# Altium schematic sheet Sch_led.SchDoc
size Letter
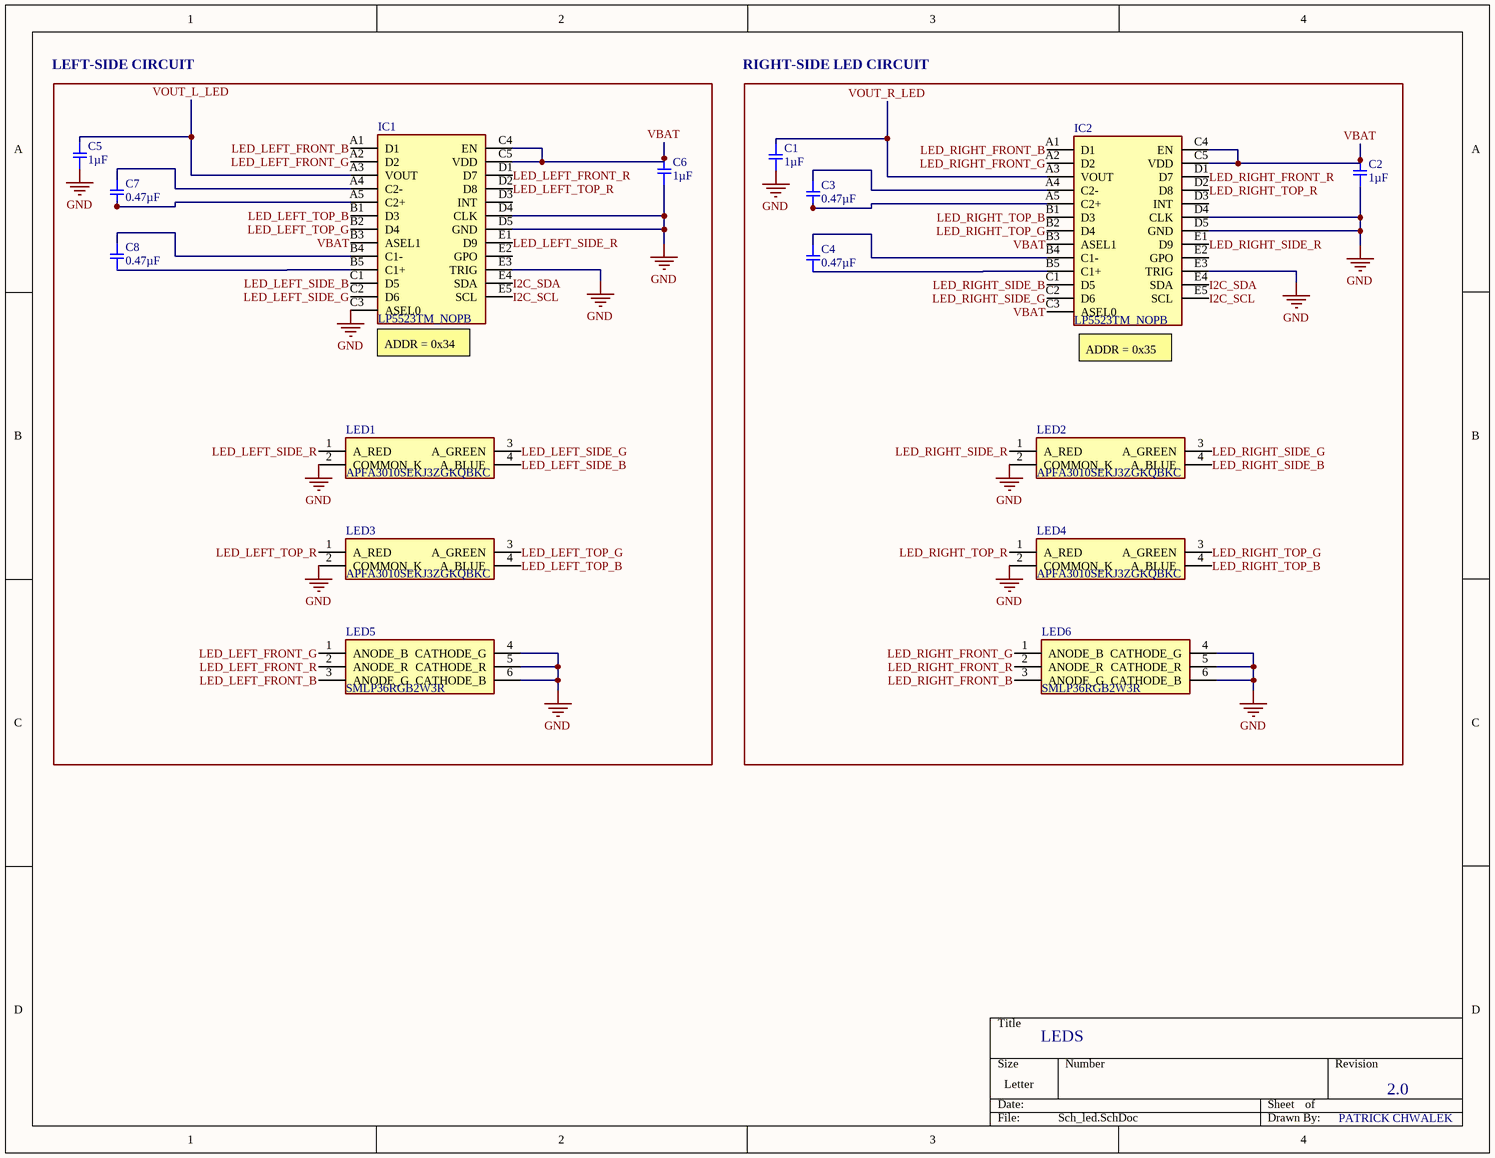
[diagram p0: Sch_led.SchDoc]

## Parts
C1  1µF  [0402R]
C2  1µF  [0402R]
C3  0.47µF  [0402R]
C4  0.47µF  [0402R]
C5  1µF  [0402R]
C6  1µF  [0402R]
C7  0.47µF  [0402R]
C8  0.47µF  [0402R]
IC1  LP5523TM_NOPB  [BGA25C40P5X5_226X226X68]
IC2  LP5523TM_NOPB  [BGA25C40P5X5_226X226X68]
LED1  APFA3010SEKJ3ZGKQBKC  [KPFA-3010RGBC-11]
LED2  APFA3010SEKJ3ZGKQBKC  [KPFA-3010RGBC-11]
LED3  APFA3010SEKJ3ZGKQBKC  [KPFA-3010RGBC-11]
LED4  APFA3010SEKJ3ZGKQBKC  [KPFA-3010RGBC-11]
LED5  SMLP36RGB2W3R  [ROHM-1510-(0604)]
LED6  SMLP36RGB2W3R  [ROHM-1510-(0604)]

## Blocks framed on the sheet
LEFT-SIDE CIRCUIT: C5-C8 IC1 LED1 LED3 LED5
RIGHT-SIDE LED CIRCUIT: C1-C4 IC2 LED2 LED4 LED6

## Nets
GND: C1.1 C2.1 C5.1 C6.1 IC1.C3(ASEL0) IC1.D4(CLK) IC1.D5(GND) IC1.E3(TRIG) IC2.D4(CLK) IC2.D5(GND) IC2.E3(TRIG) LED1.2(COMMON_K) LED2.2(COMMON_K) LED3.2(COMMON_K) LED4.2(COMMON_K) LED5.4(CATHODE_G) LED5.5(CATHODE_R) LED5.6(CATHODE_B) LED6.4(CATHODE_G) LED6.5(CATHODE_R) LED6.6(CATHODE_B)
I2C_SCL: IC1.E5(SCL) IC2.E5(SCL)
I2C_SDA: IC1.E4(SDA) IC2.E4(SDA)
LED_LEFT_FRONT_B: IC1.A1(D1) LED5.3(ANODE_G)
LED_LEFT_FRONT_G: IC1.A2(D2) LED5.1(ANODE_B)
LED_LEFT_FRONT_R: IC1.D1(D7) LED5.2(ANODE_R)
LED_LEFT_SIDE_B: IC1.C1(D5) LED1.4(A_BLUE)
LED_LEFT_SIDE_G: IC1.C2(D6) LED1.3(A_GREEN)
LED_LEFT_SIDE_R: IC1.E1(D9) LED1.1(A_RED)
LED_LEFT_TOP_B: IC1.B1(D3) LED3.4(A_BLUE)
LED_LEFT_TOP_G: IC1.B2(D4) LED3.3(A_GREEN)
LED_LEFT_TOP_R: IC1.D2(D8) LED3.1(A_RED)
LED_RIGHT_FRONT_B: IC2.A1(D1) LED6.3(ANODE_G)
LED_RIGHT_FRONT_G: IC2.A2(D2) LED6.1(ANODE_B)
LED_RIGHT_FRONT_R: IC2.D1(D7) LED6.2(ANODE_R)
LED_RIGHT_SIDE_B: IC2.C1(D5) LED2.4(A_BLUE)
LED_RIGHT_SIDE_G: IC2.C2(D6) LED2.3(A_GREEN)
LED_RIGHT_SIDE_R: IC2.E1(D9) LED2.1(A_RED)
LED_RIGHT_TOP_B: IC2.B1(D3) LED4.4(A_BLUE)
LED_RIGHT_TOP_G: IC2.B2(D4) LED4.3(A_GREEN)
LED_RIGHT_TOP_R: IC2.D2(D8) LED4.1(A_RED)
VBAT: C2.2 C6.2 IC1.B3(ASEL1) IC1.C4(EN) IC1.C5(VDD) IC2.B3(ASEL1) IC2.C3(ASEL0) IC2.C4(EN) IC2.C5(VDD)
VOUT_L_LED: C5.2 IC1.A3(VOUT)
VOUT_R_LED: C1.2 IC2.A3(VOUT)
NetC3_1: C3.1 IC2.A5(C2+)
NetC3_2: C3.2 IC2.A4(C2-)
NetC4_1: C4.1 IC2.B5(C1+)
NetC4_2: C4.2 IC2.B4(C1-)
NetC7_1: C7.1 IC1.A5(C2+)
NetC7_2: C7.2 IC1.A4(C2-)
NetC8_1: C8.1 IC1.B5(C1+)
NetC8_2: C8.2 IC1.B4(C1-)

Not connected (* = marked no-connect by the designer): IC1 D3(INT) E2(GPO); IC2 D3(INT) E2(GPO)

## Notes on the sheet
- (near IC1) ADDR = 0x34
- (near IC2) ADDR = 0x35
- LEDS
- 2.0
- PATRICK CHWALEK

## Library data of the parts
C1 C2 C5 C6 = GCM155C71A105KE38D: CAP CER 1UF 10V X7S 0402; Manufacturer: Murata Electronics North America; Factory Stock: 0; Unit Price (USD): 0.12; Minimum Quantity: 1; Tolerance: ±10%; Datasheets: http://www.murata.com/~/media/webrenewal/support/library/catalog/products/capacitor/mlcc/c03e.ashx; Image: //media.digikey.com/Renders/Murata%20Renders/ZRB-SERIES-0402.jpg; Digi-Key Part Number: 490-13409-1-ND; Part Number: GCM155C71A105KE38D; Quantity Available: 7240; @ qty: 0; Packaging: Cut Tape (CT); Series: GCM; Part Status: Active; Value: 1µF; Voltage: 10V; Temperature Coefficient: X7S; Operating Temperature: -55°C ~ 125°C; Features: -; Ratings: AEC-Q200; Applications: Automotive; Mounting Type: Surface Mount, MLCC; Package / Case: 0402 (1005 Metric); Size / Dimension: 0.039" L x 0.020" W (1.00mm x 0.50mm); Height - Seated (Max): -; Thickness (Max): 0.022" (0.55mm); Lead Spacing: -; Lead Style: -
C3 C4 C7 C8 = GCM155C71A105KE38D: CAP CER 0.47UF 10V X7S 0402; Manufacturer: Murata Electronics North America; Factory Stock: 0; Unit Price (USD): 0.12; Minimum Quantity: 1; Tolerance: ±10%; Datasheets: http://www.murata.com/~/media/webrenewal/support/library/catalog/products/capacitor/mlcc/c03e.ashx; Image: //media.digikey.com/Renders/Murata%20Renders/ZRB-SERIES-0402.jpg; Digi-Key Part Number: 490-13409-1-ND; Part Number: GCM155C71A105KE38D; Quantity Available: 7240; @ qty: 0; Packaging: Cut Tape (CT); Series: GCM; Part Status: Active; Value: 0.47µF; Voltage: 10V; Temperature Coefficient: X7S; Operating Temperature: -55°C ~ 125°C; Features: -; Ratings: AEC-Q200; Applications: Automotive; Mounting Type: Surface Mount, MLCC; Package / Case: 0402 (1005 Metric); Size / Dimension: 0.039" L x 0.020" W (1.00mm x 0.50mm); Height - Seated (Max): -; Thickness (Max): 0.022" (0.55mm); Lead Spacing: -; Lead Style: -
IC1 IC2 = LP5523TM_NOPB: Integrated Circuit; Manufacturer_Name: Texas Instruments; Manufacturer_Part_Number: LP5523TM/NOPB; Datasheet Link: http://www.ti.com/lit/gpn/lp5523; Height: 0.675mm
LED1-LED4 = APFA3010SEKJ3ZGKQBKC: LED; Manufacturer_Name: Kingbright; Allied_Number: 70820377; Datasheet Link: http://www.kingbrightusa.com/images/catalog/SPEC/APFA3010SEKJ3ZGKQBKC.pdf; Manufacturer_Part_Number: APFA3010SEKJ3ZGKQBKC; Mouser Part Number: 604-APFA3010SEKJ3ZGK; Mouser Price/Stock: https://www.mouser.com/Search/Refine.aspx?Keyword=604-APFA3010SEKJ3ZGK; Allied Price/Stock: https://www.alliedelec.com/kingbright-apfa3010sekj3zgkqbkc/70820377/
LED5 LED6 = SMLP36RGB2W3R: LED; Manufacturer_Name: ROHM Semiconductor; Datasheet Link: http://www.rohm.com/web/global/datasheet/SMLP36RGB2W(R); Manufacturer_Part_Number: SMLP36RGB2W3R; Mouser Part Number: 755-SMLP36RGB2W3R; Mouser Price/Stock: https://www.mouser.com/Search/Refine.aspx?Keyword=755-SMLP36RGB2W3R; RS Part Number: 1246884; RS Price/Stock: https://uk.rs-online.com/web/p/products/1246884